# EAGLE design 5_to_var_new (EAGLE 6.1)
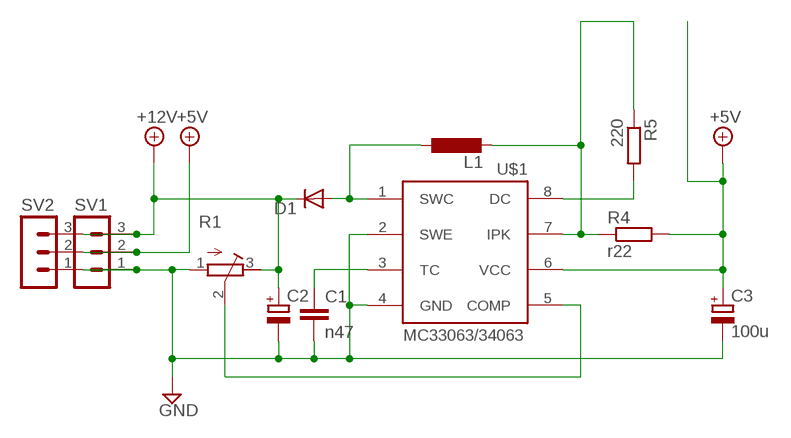
[diagram p0: schematic, sheet 1]

## Parts
C1  n47  C-EU025-025X050  [C025-025X050]
C2  CPOL-EUE3.5-8  [E3,5-8]
C3  100u  CPOL-EUE2.5-7  [E2,5-7]
D1  DIODE-D-2.5  [D-2.5]
L1  L-EU0207/2V  [0207/2V]
R1  R-TRIMM3296X  [RTRIM3296X]
R4  r22  R-EU_0207/2V  [0207/2V]
R5  220  R-EU_0207/2V  [0207/2V]
SV1  MA03-1  [MA03-1]
SV2  MA03-1  [MA03-1]
U$1  MC33063/MC34063P  [DIL08]

## Nets
+5V: C3.+ R4.2 SV1.2 SV2.2 U$1.6(VCC)
+12V: C2.+ D1.C R1.3(E) SV1.3 SV2.3
GND: C1.2 C2.- C3.- R1.1(A) SV1.1 SV2.1 U$1.2(SWE) U$1.4(GND)
N$1: R5.2 U$1.8(DC)
N$2: L1.2 R4.1 R5.1 U$1.7(IPK)
N$7: C1.1 U$1.3(TC)
N$8: D1.A L1.1 U$1.1(SWC)
N$9: R1.2(S) U$1.5(COMP)

## Library data of the parts
C1 = rcl:C-EU: CAPACITOR, European symbol
C2 C3 = rcl:CPOL-EU: POLARIZED CAPACITOR, European symbol
D1 = diode:DIODE-: DIODE
L1 = rcl:L-EU: INDUCTOR, European symbol
R1 = rcl:R-TRIMM: Trimm resistor
R4 R5 = rcl:R-EU_: RESISTOR, European symbol
SV1 SV2 = con-lstb:MA03-1: PIN HEADER; OC_FARNELL: unknown; OC_NEWARK: unknown
U$1 = adafruit_t10:MC33063/MC34063: MC33063 and MC34063 Basic DC/DC converter with internal power-NPN transistor, 100KHz, 1.5A peak switch current. 3-40 input/output.

## Board
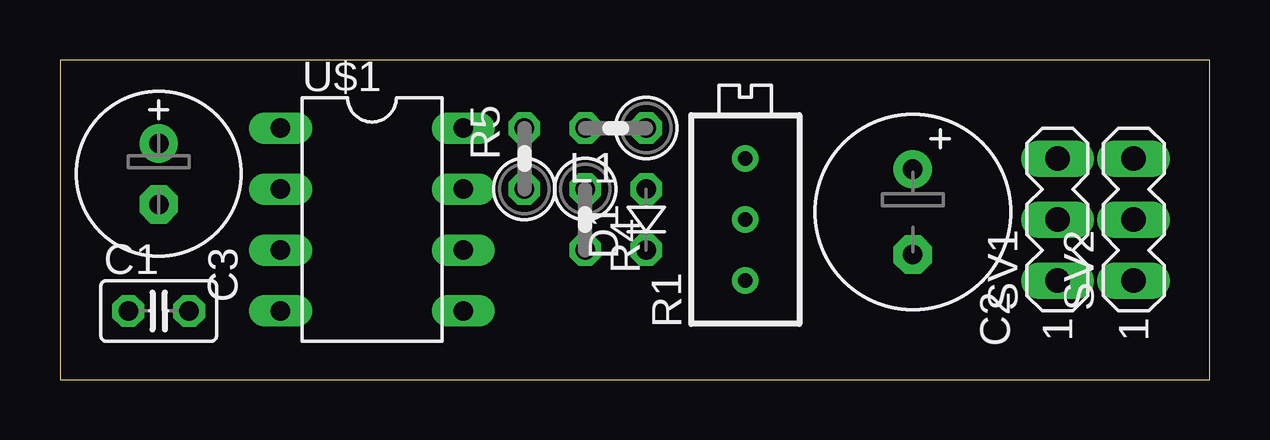
[diagram p1: board, top side]
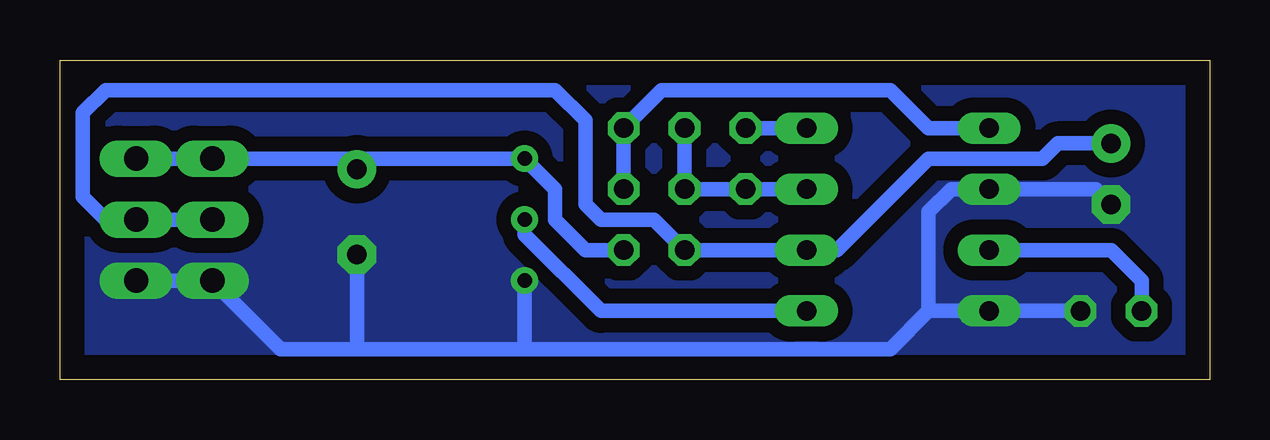
[diagram p2: board, bottom side, seen from below]

Size 47.93 x 13.31 mm. Coordinates in mm from the lower left corner, seen from the top.
Outline: 47.93,0 47.93,13.31 0,13.31 0,0 47.93,0
Copper layers (1*16): Top 0.035mm / dielectric 1.5mm / Bottom 0.035mm
Design rules: minimum track width 10mil, minimum drill 24mil, track to track 8mil, track to pad 8mil, pad to pad 8mil, via to via 8mil, smd to smd 8mil, copper to edge 40mil, drill to drill 8mil, minimum pad ring 10mil, minimum via ring 8mil, stop-mask expansion 4mil, vias tented up to drill 0mil, thermal gap 10mil

### Footprints (pad centres in the part's own frame; a part is rotated, then mirrored left to right if it is on the bottom)
C025-025X050 = drill 0.813 octagon: 1 -1.27,0; 2 1.27,0
E3,5-8 = drill 0.813 pad 1.6: + -1.778,0 | drill 0.813 pad 1.6 octagon: - 1.778,0
E2,5-7 = drill 0.813 pad 1.6: + -1.27,0 | drill 0.813 pad 1.6 octagon: - 1.27,0
D-2.5 = drill 0.813 octagon: A 1.27,0; C -1.27,0
0207/2V = drill 0.813 octagon: 1 -1.27,0; 2 1.27,0
RTRIM3296X = drill 0.61: 1 0,-2.54; 2 0,0; 3 0,2.54
MA03-1 = drill 1.016 long: 1 -2.54,0; 2 0,0; 3 2.54,0
DIL08 = drill 0.813 long: 1 -3.81,-3.81; 2 -1.27,-3.81; 3 1.27,-3.81; 4 3.81,-3.81; 5 3.81,3.81; 6 1.27,3.81; 7 -1.27,3.81; 8 -3.81,3.81

### Placement (x,y rotation side)
C1  4.12,2.86 0 top
C2  35.55,6.99 270 top
C3  4.12,8.57 270 top
D1  24.44,6.67 90 top
L1  23.16,10.48 180 top
R1  28.56,6.67 0 top
R4  21.89,6.67 270 top
R5  19.36,9.21 90 top
SV1  41.58,6.67 90 top
SV2  44.75,6.67 90 top
U$1  13.01,6.67 270 top

### Tracks (layer width: path | path; a pad name or v marks a point on that pad's centre or on a via)
+5V
  Bottom 0.61: C3.+ 6.34,9.84 6.97,9.21 11.74,9.21 15.54,5.4 U$1.6 R4.2 23.16,6.67 25.39,6.67 26.02,7.3 26.02,10.79 27.29,12.06 46.03,12.06 46.98,11.11 46.98,7.62 46.03,6.67 SV2.2 SV1.2
+12V
  Bottom 0.61: D1.C 26.02,5.4 27.29,6.67 27.29,7.94 R1.3 35.23,9.21 | 35.23,9.21 SV1.3 SV2.3 | C2.+ 35.23,9.21
GND
  Bottom 0.61: C1.2 U$1.4 11.74,2.86 | 11.74,2.86 11.74,6.99 10.78,7.94 U$1.2 4.75,7.94 C3.- | 11.74,2.86 13.32,1.27 28.56,1.27 | R1.1 28.56,1.27 | 28.56,1.27 35.55,1.27 | C2.- 35.55,1.27 | 35.55,1.27 38.72,1.27 SV1.1 SV2.1
  pour Bottom (isolate 0.61, no thermals): -0.01,0 47.93,0 47.93,13.34 -0.01,13.34
N$1
  Bottom 0.61: U$1.8 R5.2
N$2
  Bottom 0.61: U$1.7 R5.1 R4.1 L1.2
N$7
  Bottom 0.61: C1.1 2.84,4.13 4.12,5.4 U$1.3
N$8
  Bottom 0.61: U$1.1 11.74,10.48 13.32,12.06 22.85,12.06 L1.1 D1.A
N$9
  Bottom 0.61: U$1.5 25.39,2.86 28.56,6.03 R1.2